# EAGLE design dintervalometer (EAGLE 7.2.0)
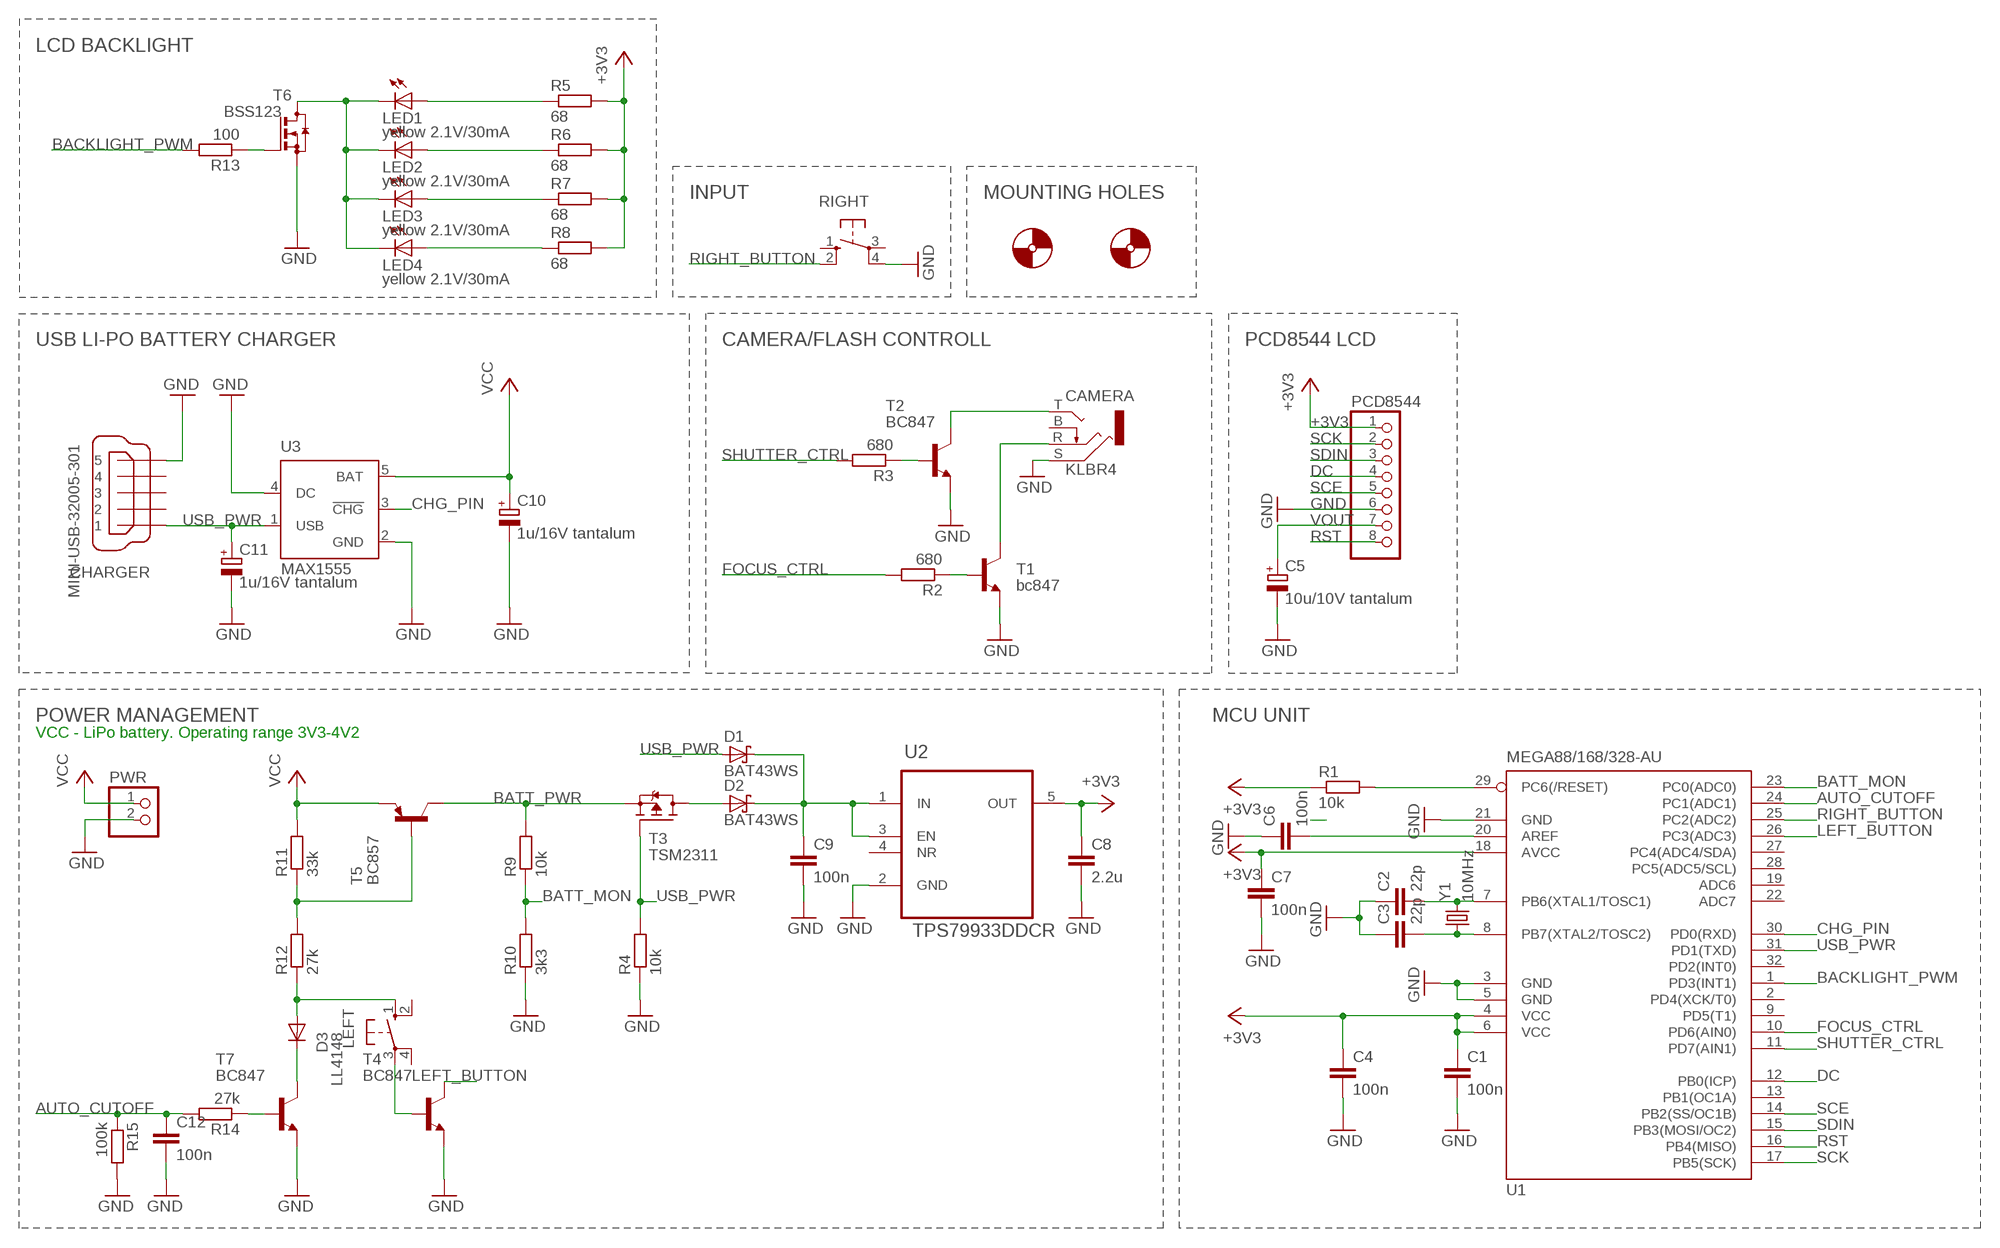
[diagram p0: schematic, sheet 1]

## Parts
C1  100n  C-EUC0805  [C0805]
C2  22p  C-EUC0805  [C0805]
C3  22p  C-EUC0805  [C0805]
C4  100n  C-EUC0805  [C0805]
C5  10u/10V tantalum  CPOL-EUSMCA  [SMC_A]
C6  100n  C-EUC0805  [C0805]
C7  100n  C-EUC0805  [C0805]
C8  2.2u  C-EUC0805  [C0805]
C9  100n  C-EUC0805  [C0805]
C10  1u/16V tantalum  CPOL-EUSMCA  [SMC_A]
C11  1u/16V tantalum  CPOL-EUSMCA  [SMC_A]
C12  100n  C-EUC0805  [C0805]
CAMERA  KLBR4  [KLBR4]
CHARGER  MINI-USB-32005-301  [32005-301]
D1  BAT43WS  [SOD323_ST]
D2  BAT43WS  [SOD323_ST]
D3  LL4148  DIODE-SOD80C  [SOD80C]
LED1  yellow 2.1V/30mA  LEDCHIP-LED0805  [CHIP-LED0805]
LED2  yellow 2.1V/30mA  LEDCHIP-LED0805  [CHIP-LED0805]
LED3  yellow 2.1V/30mA  LEDCHIP-LED0805  [CHIP-LED0805]
LED4  yellow 2.1V/30mA  LEDCHIP-LED0805  [CHIP-LED0805]
LEFT  10-XX  [B3F-10XX]
PCD8544  PINHD-1X8  [1X08]
PWR  PINHD-1X2/90  [1X02/90]
R1  10k  R-EU_M0805  [M0805]
R2  680  R-EU_M0805  [M0805]
R3  680  R-EU_M0805  [M0805]
R4  10k  R-EU_M0805  [M0805]
R5  68  R-EU_M0805  [M0805]
R6  68  R-EU_M0805  [M0805]
R7  68  R-EU_M0805  [M0805]
R8  68  R-EU_M0805  [M0805]
R9  10k  R-EU_M0805  [M0805]
R10  3k3  R-EU_M0805  [M0805]
R11  33k  R-EU_M0805  [M0805]
R12  27k  R-EU_M0805  [M0805]
R13  100  R-EU_M0805  [M0805]
R14  27k  R-EU_M0805  [M0805]
R15  100k  R-EU_M0805  [M0805]
RIGHT  10-XX  [B3F-10XX]
T1  bc847  BC847-NPN-SOT23-BEC  [SOT23-BEC]
T2  BC847  BC847-NPN-SOT23-BEC  [SOT23-BEC]
T3  TSM2311  [SOT23]
T4  BC847  [SOT23]
T5  BC857  BC857A-PNP-SOT23-BEC  [SOT23-BEC]
T6  BSS123  [SOT23]
T7  BC847  [SOT23]
U1  MEGA88/168/328-AU  MEGA8-AI  [TQFP32-08]
U2  TPS79933DDCR  TPS73033DBVT  [SOT95P290X145-5N]
U3  MAX1555  [SOT23-5L]
X1  2.8MM_HOLE  [2.8MM_HOLE]
X3  2.8MM_HOLE  [2.8MM_HOLE]
Y1  10MHz  CRYSTAL  [5X3.2MM]

## Nets
+3V3: C1.1 C4.1 C7.1 C8.1 PCD8544.1 R1.1 R5.2 R6.2 R7.2 R8.2 U1.4(VCC) U1.6(VCC) U1.18(AVCC) U2.5(OUT)
AUTO_CUTOFF: C12.1 R14.2 R15.1 U1.24(PC1(ADC1))
BACKLIGHT_PWM: R13.2 U1.1(PD3(INT1))
BATT_MON: R9.1 R10.2 U1.23(PC0(ADC0))
BATT_PWR: R9.2 T3.2(S) T5.C
CHG_PIN: U1.30(PD0(RXD)) U3.3(!CHG)
DC: PCD8544.4 U1.12(PB0(ICP))
FOCUS_CTRL: R2.2 U1.10(PD6(AIN0))
GND: C1.2 C2.1 C3.1 C4.2 C5.- C6.1 C7.2 C8.2 C9.2 C10.- C11.- C12.2 CAMERA.S CHARGER.5 PCD8544.6 PWR.2 R4.1 R10.1 R15.2 RIGHT.4(P1) T1.E T2.E T4.2(E) T6.2(S) T7.2(E) U1.3(GND) U1.5(GND) U1.21(GND) U2.2(GND) U3.2(GND) U3.4(DC)
LEFT_BUTTON: T4.3(C) U1.26(PC3(ADC3))
N$1: R1.2 U1.29(PC6(/RESET))
N$2: C2.2 U1.7(PB6(XTAL1/TOSC1)) Y1.3
N$3: C3.2 U1.8(PB7(XTAL2/TOSC2)) Y1.1
N$4: R3.1 T2.B
N$5: R11.1 R12.2 T5.B
N$6: C6.2 U1.20(AREF)
N$7: LED1.A R5.1
N$8: D3.A LEFT.1(S) R12.1
N$9: D3.C T7.3(C)
N$10: D2.A T3.3(D)
N$11: LEFT.3(P) T4.1(B)
N$12: LED1.C LED2.C LED3.C LED4.C T6.3(D)
N$13: R2.1 T1.B
N$14: R13.1 T6.1(G)
N$15: LED2.A R6.1
N$16: LED3.A R7.1
N$17: LED4.A R8.1
N$18: CAMERA.T T2.C
N$19: CAMERA.R T1.C
N$20: R14.1 T7.1(B)
N$21: C9.1 D1.C D2.C U2.1(IN) U2.3(EN)
RIGHT_BUTTON: RIGHT.2(S1) U1.25(PC2(ADC2))
RST: PCD8544.8 U1.16(PB4(MISO))
SCE: PCD8544.5 U1.14(PB2(SS/OC1B))
SCK: PCD8544.2 U1.17(PB5(SCK))
SDIN: PCD8544.3 U1.15(PB3(MOSI/OC2))
SHUTTER_CTRL: R3.2 U1.11(PD7(AIN1))
USB_PWR: C11.+ CHARGER.1 D1.A R4.2 T3.1(G) U1.31(PD1(TXD)) U3.1(USB)
VCC: C10.+ PWR.1 R11.2 T5.E U3.5(BAT)
VOUT: C5.+ PCD8544.7
Unconnected: CAMERA.B CHARGER.2 CHARGER.3 CHARGER.4 LEFT.2(S1) LEFT.4(P1) RIGHT.1(S) RIGHT.3(P) U1.2(PD4(XCK/T0)) U1.9(PD5(T1)) U1.13(PB1(OC1A)) U1.19(ADC6) U1.22(ADC7) U1.27(PC4(ADC4/SDA)) U1.28(PC5(ADC5/SCL)) U1.32(PD2(INT0)) U2.4(NR)

## Notes on the sheet
- LCD BACKLIGHT
- INPUT | MOUNTING HOLES
- USB LI-PO BATTERY CHARGER | CAMERA/FLASH CONTROLL | PCD8544 LCD
- POWER MANAGEMENT | MCU UNIT
- VCC - LiPo battery. Operating range 3V3-4V2

## Library data of the parts
C1-C4 C6-C9 C12 = rcl:C-EU: CAPACITOR, European symbol
C5 C10 C11 = rcl:CPOL-EU: POLARIZED CAPACITOR, European symbol
CAMERA = con-lumberg:KLBR4: Jack connectors according to JISC 6560, 3.5 mm Klinkeneinbaukupplung nach JISC 6560, 3,5 mm, 3-polig/ stereo, abgewinkelte Ausführung, mit Öffner, für Leiterplatten Source: Data sheet <http://www.lumberg.com/Produkte/PDFs/KLBR4.pdf>; MPN: KLBR 4; OC_FARNELL: 1217016; OC_NEWARK: 97K2709
CHARGER = con-cypressindustries:MINI-USB-: MINI USB-B Conector Source: www.cypressindustries.com; OC_FARNELL: unknown; OC_NEWARK: unknown
D1 D2 = diode:BAT43WS
D3 = diode:DIODE-: DIODE
LED1-LED4 = led:LED: LED OSRAM: - CHIPLED LG R971, LG N971, LY N971, LG Q971, LY Q971, LO R971, LY R971 LH N974, LH R974 LS Q976, LO Q976, LY Q976 LO Q996 - Hyper CHIPLED LW Q18S LB Q993, LB Q99A, LB R99A - SideLED LS A670, LO A670, LY A670, LG A670, LP A670 LB A673, LV A673, LT A673, LW A673 LH A674 LY A675 LS A676, LA A676, LO A676, LY A676, LW A676 LS A679, LY A679, LG A679 - Hyper Micro SIDELED® LS Y876, LA Y876, LO Y876, LY Y876 LT Y87S - SmartLED LW L88C, LW L88S LB L89C, LB L89S, LG L890 LS L89K, LO L89K, LY L89K LS L896, LA L896, LO L896, LY L896 - TOPLED LS T670, LO T670, LY T670, LG T670, LP T670 LSG T670, LSP T670, LSY T670, LOP T670, LYG T670 LG T671, LOG T671, LSG T671 LB T673, LV T673, LT T673, LW T673 LH T674 LS T676, LA T676, LO T676, LY T676, LB T676, LH T676, LSB T676, LW T676 LB T67C, LV T67C, LT T67C, LS T67K, LO T67K, LY T67K, LW E67C LS E67B, LA E67B, LO E67B, LY E67B, LB E67C, LV E67C, LT E67C LW T67C LS T679, LY T679, LG T679 LS T770, LO T770, LY T770, LG T770, LP T770 LB T773, LV T773, LT T773, LW T773 LH T774 LS E675, LA E675, LY E675, LS T675 LS T776, LA T776, LO T776, LY T776, LB T776 LHGB T686 LT T68C, LB T68C - Hyper Mini TOPLED® LB M676 - Mini TOPLED Santana® LG M470 LS M47K, LO M47K, LY M47K Source: http://www.osram.convergy.de LUXEON: - LUMILED® LXK2-PW12-R00, LXK2-PW12-S00, LXK2-PW14-U00, LXK2-PW14-V00 LXK2-PM12-R00, LXK2-PM12-S00, LXK2-PM14-U00 LXK2-PE12-Q00, LXK2-PE12-R00, LXK2-PE12-S00, LXK2-PE14-T00, LXK2-PE14-U00 LXK2-PB12-K00, LXK2-PB12-L00, LXK2-PB12-M00, LXK2-PB14-N00, LXK2-PB14-P00, LXK2-PB14-Q00 LXK2-PR12-L00, LXK2-PR12-M00, LXK2-PR14-Q00, LXK2-PR14-R00 LXK2-PD12-Q00, LXK2-PD12-R00, LXK2-PD12-S00 LXK2-PH12-R00, LXK2-PH12-S00 LXK2-PL12-P00, LXK2-PL12-Q00, LXK2-PL12-R00 Source: www.luxeon.com KINGBRIGHT: KA-3528ASYC Source: www.kingbright.com
LEFT RIGHT = switch-omron:10-XX: OMRON SWITCH; MPN: B3F-1000; OC_FARNELL: 176432; OC_NEWARK: 36M3542
PCD8544 = pinhead:PINHD-1X8: PIN HEADER
PWR = pinhead:PINHD-1X2: PIN HEADER
R1-R15 = rcl:R-EU_: RESISTOR, European symbol
T1 T2 = transistor-neu-to92:*-NPN-: NPN Transistror
T3 = transistor-fet:TSM2311: 20V P-Channel MOSFET
T4 T7 = transistor:BC847: NPN TRANSISTOR
T5 = transistor:*-PNP-: PNP Transistror
T6 = transistor-small-signal:BSS123: N-CHANNEL MOS FET
U1 = atmel:MEGA8: MICROCONTROLLER 8 Kbytes FLASH, 1 kbytes SRAM, 512 bytes EEPROM, USART, 6-channel 10 bit ADC, 2-channel 8 bit ADC Pin compatible with Atmega48, ATMega88, ATMega168 Source: avr.lbr; MPN: ATMEGA8-16AU; OC_FARNELL: 9171371; OC_NEWARK: 73M8863
U2 = TPS799:TPS73033DBVT: V REG LDO 0.2A +3.3V, SOT-23-5; MPN: TPS73033DBVT; OC_FARNELL: 1135395; OC_NEWARK: 71J8233; PACKAGE: SOT-23-5; SUPPLIER: TEXAS INSTRUMENTS
U3 = maxim:MAX1555: Dual-Input USB/AC Adapter 1-Cell Li+ Battery Chargers Source: http://www.maxim-ic.com .. MAX1551-MAX1555.pdf; MF: MAXIM; MPN: MAX1555EZK+T; OC_FARNELL: 1628222; OC_NEWARK: 59J2761
X1 X3 = dhole:2.8MM_HOLE
Y1 = crystal:CRYSTAL: CRYSTAL

## Board
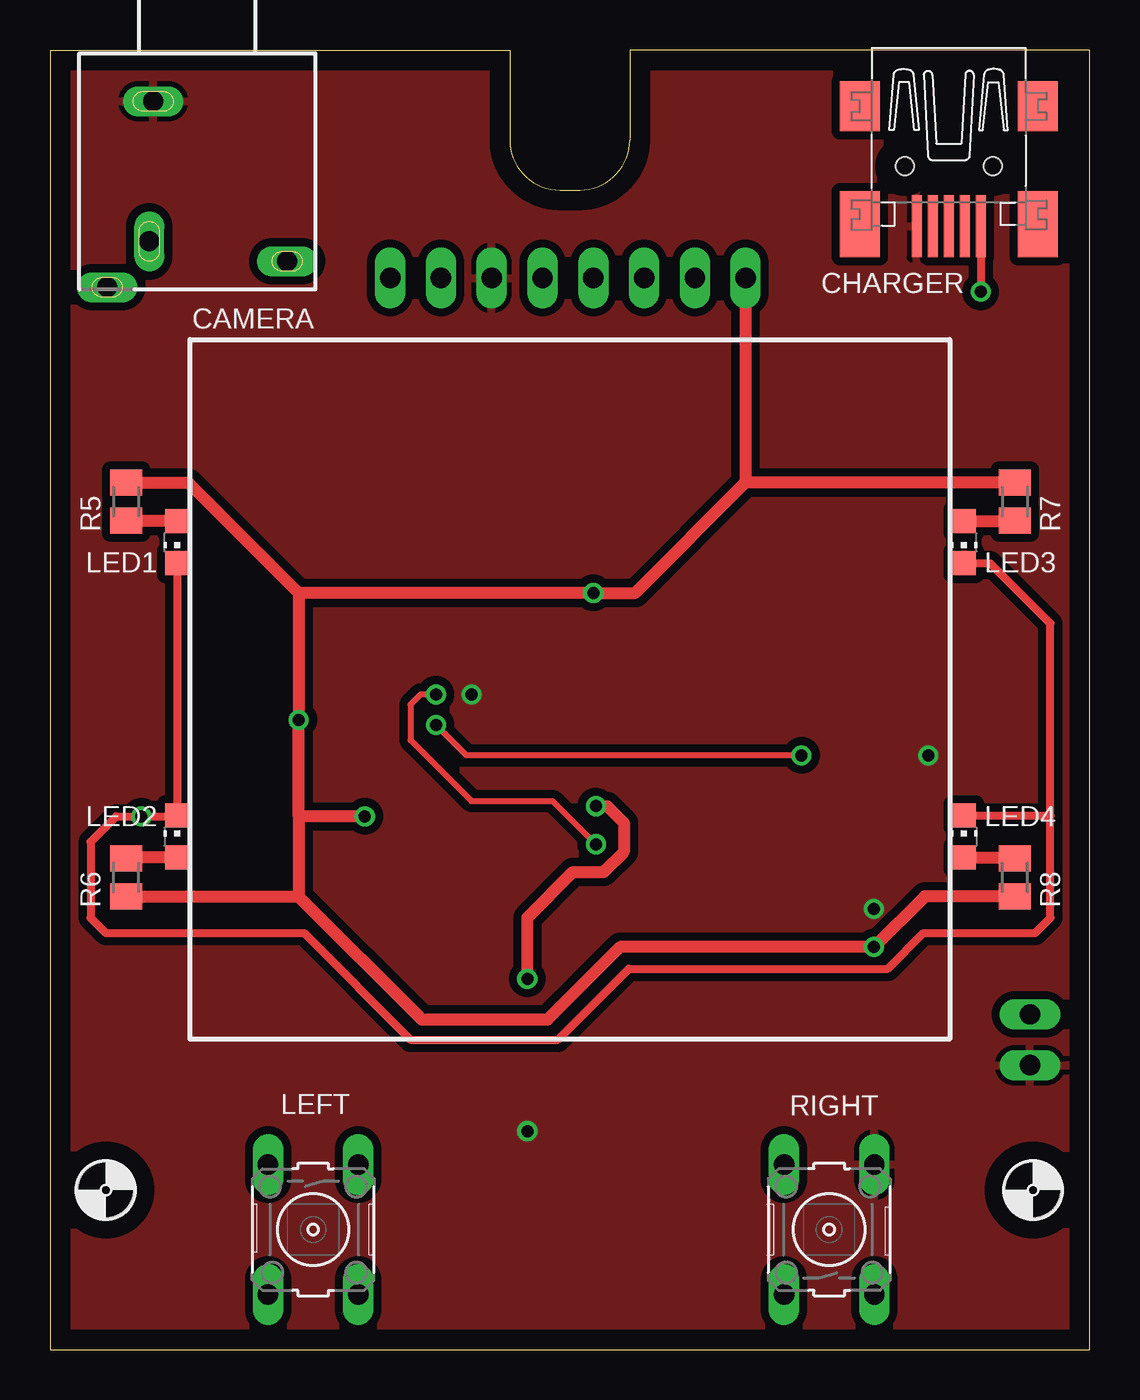
[diagram p1: board, top side]
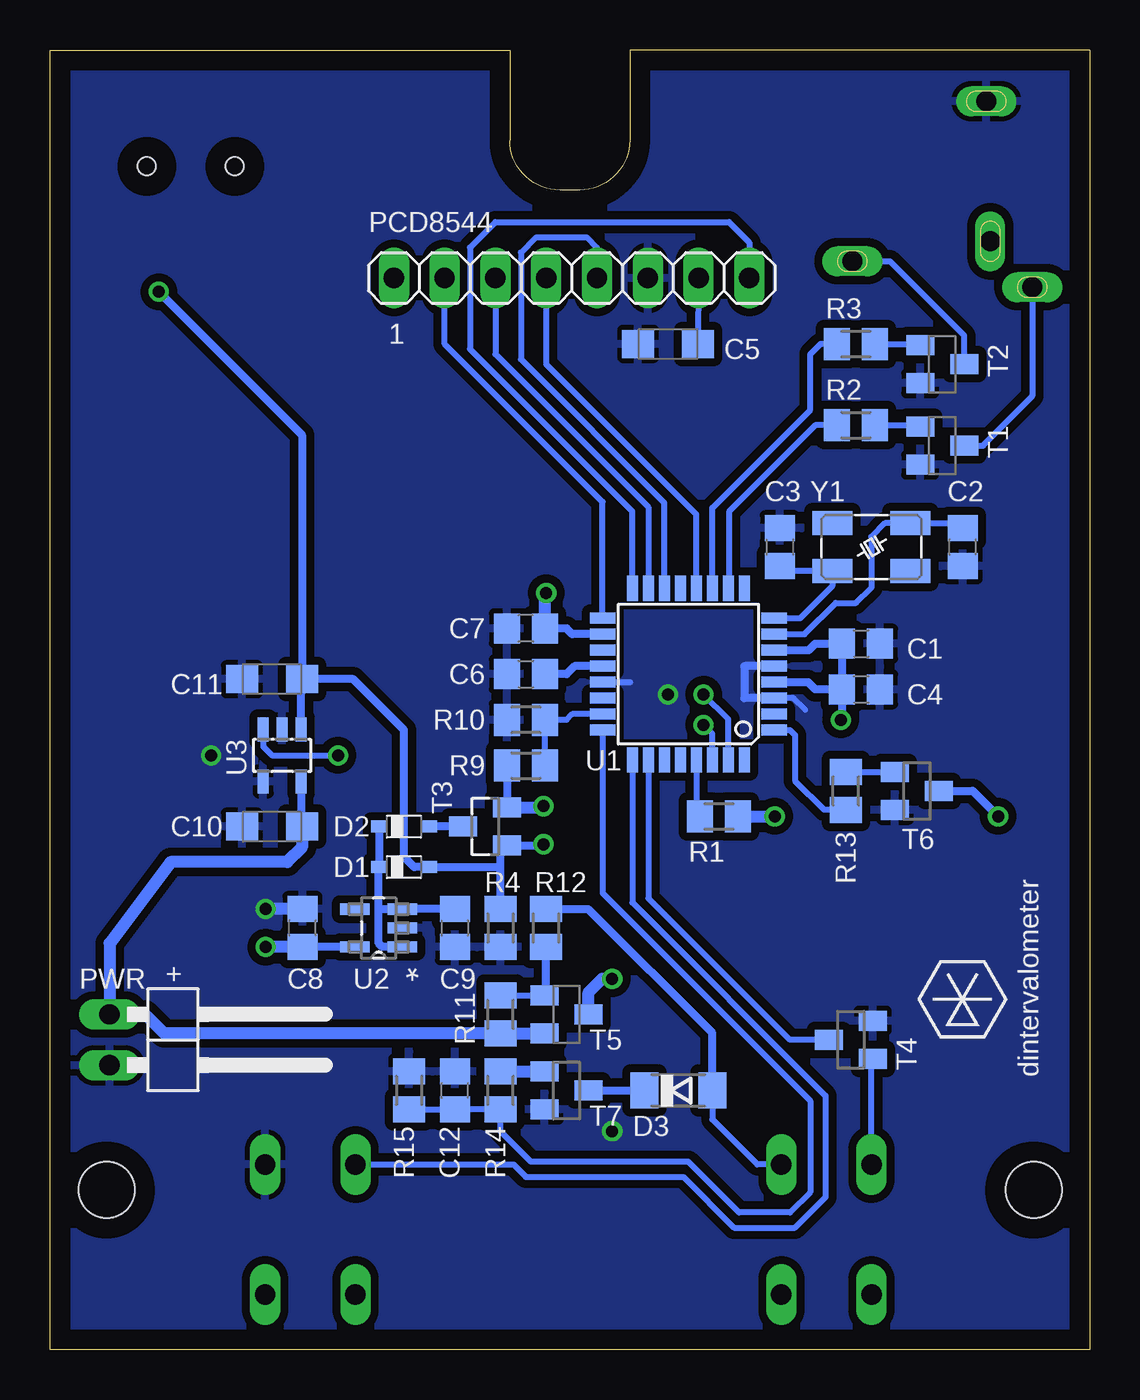
[diagram p2: board, bottom side, seen from below]

Size 52 x 65 mm. Coordinates in mm from the lower left corner, seen from the top.
Outline: 0,0 52,0 52,65 29,65 29,60.5 arc-90 26.5,58 25.5,58 arc-90 23,60.5 23,65 0,65 0,0
Copper layers (1*16): Top 0.035mm / dielectric 1.5mm / Bottom 0.035mm
Design rules "default *": minimum track width 12mil, minimum drill 23mil, track to track 10mil, track to pad 10mil, pad to pad 8mil, via to via 10mil, smd to smd 8mil, copper to edge 40mil, drill to drill 8mil, minimum pad ring 10mil, minimum via ring 8mil, stop-mask expansion 4mil, vias tented up to drill 0mil, thermal gap 10mil

### Footprints (pad centres in the part's own frame; a part is rotated, then mirrored left to right if it is on the bottom)
C0805 = smd 1.3 x 1.5: 1 -0.95,0; 2 0.95,0
SMC_A = smd 1.6 x 1.4: + -1.5,0; - 1.5,0
KLBR4 = drill 1 pad 1.3 long: B -2.4,-3.5; S -2.2,3.5 | drill 1 pad 1.2 long: R -4.5,-5.8; T 4.5,-4.5
32005-301 = smd 3.1 x 0.5: 1 3,1.6; 2 3,0.8; 3 3,0; 4 3,-0.8; 5 3,-1.6 | smd 2.5 x 2: M1 -3,-4.45; M2 -3,4.45 | smd 3.3 x 2: M3 2.9,4.45; M4 2.9,-4.45 | hole 0.9: 0,2.2; 0,-2.2
SOD323_ST = smd 0.8 x 0.6: A 1.25,0; C -1.25,0
SOD80C = smd 1.4 x 1.8: A 1.7,0; C -1.7,0
CHIP-LED0805 = smd 1.2 x 1.2: A 0,-1.05; C 0,1.05
B3F-10XX = drill 1.016 long: 1 -3.251,2.261; 2 3.251,2.261; 3 -3.251,-2.261; 4 3.251,-2.261
1X08 = drill 1.016 long: 1 -8.89,0; 2 -6.35,0; 3 -3.81,0; 4 -1.27,0; 5 1.27,0; 6 3.81,0; 7 6.35,0; 8 8.89,0
1X02/90 = drill 1.016 long: 1 -1.27,-3.81; 2 1.27,-3.81
M0805 = smd 1.3 x 1.6: 1 -0.95,0; 2 0.95,0
SOT23-BEC = smd 1 x 1.4: B -0.95,-1.1; C 0,1.1; E 0.95,-1.1
SOT23 = smd 1 x 1.4: 1 -0.95,-1.1; 2 0.95,-1.1; 3 0,1.1
TQFP32-08 = smd 1.27 x 0.559: 1 -4.293,2.8; 2 -4.293,2; 3 -4.293,1.2; 4 -4.293,0.4; 5 -4.293,-0.4; 6 -4.293,-1.2; 7 -4.293,-2; 8 -4.293,-2.8; 17 4.293,-2.8; 18 4.293,-2; 19 4.293,-1.2; 20 4.293,-0.4; 21 4.293,0.4; 22 4.293,1.2; 23 4.293,2; 24 4.293,2.8 | smd 0.559 x 1.27: 9 -2.8,-4.293; 10 -2,-4.293; 11 -1.2,-4.293; 12 -0.4,-4.293; 13 0.4,-4.293; 14 1.2,-4.293; 15 2,-4.293; 16 2.8,-4.293; 25 2.8,4.293; 26 2,4.293; 27 1.2,4.293; 28 0.4,4.293; 29 -0.4,4.293; 30 -1.2,4.293; 31 -2,4.293; 32 -2.8,4.293
SOT95P290X145-5N = smd 1.473 x 0.559: 1 -1.194,0.94; 2 -1.194,0; 3 -1.194,-0.94; 4 1.194,-0.94; 5 1.194,0.94
SOT23-5L = smd 0.55 x 1.2: 1 -0.95,-1.3; 2 0,-1.3; 3 0.95,-1.3; 4 0.95,1.3; 5 -0.95,1.3
2.8MM_HOLE = hole 2.8: 0,0
5X3.2MM = smd 2 x 1.2: 1 -1.95,-1.2; 2 1.95,-1.2; 3 1.95,1.2; 4 -1.95,1.2

### Placement (x,y rotation side)
C1  11.43,35.31 0 bottom
C2  6.35,40.13 90 bottom
C3  15.49,40.13 270 bottom
C4  11.43,33.02 0 bottom
C5  21.08,50.29 180 bottom
C6  28.19,33.78 0 bottom
C7  28.19,36.07 180 bottom
C8  39.37,21.08 90 bottom
C9  31.75,21.08 270 bottom
C10  40.89,26.16 180 bottom
C11  40.89,33.53 180 bottom
C12  31.75,12.95 90 bottom
CAMERA  7.37,58.93 0 top
CHARGER  44.96,59.18 270 top
D1  34.29,24.13 0 bottom
D2  34.29,26.16 0 bottom
D3  20.57,12.95 0 bottom
LED1  6.35,40.39 180 top
LED2  6.35,25.65 0 top
LED3  45.72,40.39 180 top
LED4  45.72,25.65 0 top
LEFT  13.16,6 270 top
PCD8544  25.91,53.59 0 bottom
PWR  45.21,15.49 270 bottom
R1  18.54,26.67 180 bottom
R2  11.68,46.23 180 bottom
R3  11.68,50.29 180 bottom
R4  29.46,21.08 90 bottom
R5  3.81,42.42 90 top
R6  3.81,23.62 270 top
R7  48.26,42.42 90 top
R8  48.26,23.62 270 top
R9  28.19,29.21 180 bottom
R10  28.19,31.5 0 bottom
R11  29.46,16.76 270 bottom
R12  27.18,21.08 270 bottom
R13  12.19,27.94 270 bottom
R14  29.46,12.95 270 bottom
R15  34.04,12.95 90 bottom
RIGHT  38.98,6 90 top
T1  7.37,45.21 270 bottom
T2  7.37,49.28 270 bottom
T3  30.23,26.16 90 bottom
T4  11.94,15.49 90 bottom
T5  26.16,16.76 270 bottom
T6  8.64,27.94 270 bottom
T7  26.16,12.95 270 bottom
U1  20.07,33.78 180 bottom
U2  35.56,21.08 180 bottom
U3  40.39,29.72 180 bottom
X1  49.17,7.98 0 top
X3  2.79,7.98 0 top
Y1  10.92,40.13 0 bottom

### Tracks (layer width: path | path; a pad name or v marks a point on that pad's centre or on a via)
+3V3  (via drill 0.6)
  Top 0.61: PCD8544.1 34.8,43.37 | R8.2 43.75,22.67 v41.21,20.13 28.51,20.13 24.89,16.51 18.61,16.51 12.45,22.67 | R6.2 12.45,22.67 | 12.45,26.67 v12.45,31.5 12.45,37.85 | v15.75,26.67 12.45,26.67 | 12.45,26.67 12.45,22.67 | R7.2 34.8,43.37 | 34.8,43.37 29.28,37.85 v27.18,37.85 12.45,37.85 | R5.2 6.92,43.37 12.45,37.85
  Bottom 0.305: 39.36,20.14 C8.1
  Bottom 0.406: 18.03,26.48 R1.1 | U1.6 14.04,34.98 13.72,35.31 C1.1 C4.1 | U1.4 14.08,33.38 13.72,33.02 C4.1 | C4.1 12.38,31.56 | U2.5 39.36,20.14 | U1.18 25.88,35.78 26.16,36.07 C7.1
  Bottom 0.61: R1.1 v15.75,26.67 | 12.38,31.56 v12.45,31.5 | C8.1 v41.21,20.13 | C7.1 27.24,37.78 v27.18,37.85
AUTO_CUTOFF
  Bottom 0.305: U1.24 24.36,22.84 13.97,12.45 13.97,7.87 14.99,6.86 17.53,6.86 20.07,9.4 27.94,9.4 29.46,10.92 R14.2 C12.1 R15.1
BACKLIGHT_PWM
  Bottom 0.305: R13.2 13.27,26.99 14.73,28.45 14.73,30.73 14.98,30.98 U1.1
BATT_MON
  Bottom 0.305: R9.1 R10.2 26.16,31.5 25.88,31.78 U1.23
BATT_PWR  (via drill 0.6)
  Top 0.61: v27.3,27.18 27.87,27.18 28.7,26.35 28.7,24.89 27.69,23.88 26.16,23.88 23.88,21.59 v23.88,18.54
  Bottom 0.305: 29.14,27.5 29.13,27.77 T3.2
  Bottom 0.406: R9.2 29.14,27.5 | T5.C 25.32,16.68
  Bottom 0.61: T3.2 27.37,27.11 v27.3,27.18 | v23.88,18.54 24.38,18.54 25.06,17.86 T5.C
CHG_PIN  (via drill 0.6)
  Top 0.305: v37.59,29.72 20.83,29.72 v19.3,31.24
  Bottom 0.305: U3.3 41.34,30.16 40.89,29.72 v37.59,29.72 | U1.30 18.87,30.8 v19.3,31.24
DC
  Bottom 0.305: PCD8544.4 27.18,49.28 19.67,41.76 U1.12
FOCUS_CTRL
  Bottom 0.305: R2.2 13.72,46.23 18.03,41.91 18.03,38.11 U1.10
GND  (via drill 0.6)
  Bottom 0.305: 14.22,32 14.8,32.58 U1.3 | U1.21 22.97,33.38
  Bottom 0.406: 29.4,34.04 C6.1 | U1.5 17.27,34.18 17.27,32.58 U1.3
  Bottom 0.61: C8.2 v41.21,22.03
  other vias: 43.94,29.72 21.08,32.77 23.88,10.92
  pour Bottom (isolate 0.406): 0.25,65.02 52.07,65.02 52.07,0 0,0 0,65.02
  pour Top (isolate 0.406): 0.25,65.02 52.07,65.02 52.07,0 0,0 0,65.02
LEFT_BUTTON
  Bottom 0.305: U1.26 22.07,22.57 14.99,15.49 T4.3
N$1
  Bottom 0.305: U1.29 19.67,26.67 R1.2
N$2
  Bottom 0.305: U1.7 14.26,35.78 12.7,37.34 11.68,37.34 10.92,38.1 10.92,40.64 10.23,41.33 Y1.3 6.6,41.33 C2.2
N$3
  Bottom 0.305: C3.2 15.74,38.93 Y1.1 12.87,38.18 14.47,36.58 U1.8
N$4
  Bottom 0.305: R3.1 8.53,50.29 T2.B
N$5
  Bottom 0.305: R11.1 T5.B
  Bottom 0.406: T5.B 27.18,17.71 R12.2
N$6
  Bottom 0.406: U1.20 25.76,34.18 26.16,33.78 C6.2
N$7
  Top 0.61: LED1.A 3.81,41.44 R5.1
N$8
  Bottom 0.305: LEFT.1 16.62,9.25 18.87,11.51 D3.A
  Bottom 0.406: R12.1 25.08,22.03 18.87,15.83 D3.A
N$9
  Bottom 0.406: T7.3 D3.C
N$10
  Bottom 0.406: T3.3 D2.A
N$11
  Bottom 0.305: LEFT.3 10.9,14.48 T4.1
N$12  (via drill 0.6)
  Top 0.406: v4.57,26.67 6.38,26.67 LED2.C | LED1.C LED2.C | LED2.C 6.32,26.67 3.3,26.67 2.03,25.4 2.03,21.59 2.79,20.83 12.7,20.83 18.03,15.49 25.4,15.49 28.96,19.05 41.91,19.05 43.69,20.83 49.28,20.83 50.04,21.59 50.04,26.7 | 50.04,26.7 50.04,36.32 47.02,39.34 LED3.C | LED4.C 50.04,26.7
  Bottom 0.406: T6.3 5.84,27.94 v4.57,26.67
N$13
  Bottom 0.305: R2.1 8.53,46.23 T1.B
N$14
  Bottom 0.305: R13.1 T6.1
N$15
  Top 0.61: LED2.A 3.81,24.6 R6.1
N$16
  Top 0.61: LED3.A 48.23,41.44 R7.1
N$17
  Top 0.61: LED4.A 48.23,24.6 R8.1
N$18
  Bottom 0.305: CAMERA.T 9.98,54.43 6.27,50.72 T2.C
N$19
  Bottom 0.305: CAMERA.R 2.87,47.68 5.33,45.21 T1.C
N$20
  Bottom 0.61: R14.1 T7.1
N$21
  Bottom 0.305: 35.48,22.02 35.56,22.1 | 34.36,22.03 U2.3 | 35.56,24.11 D1.C
  Bottom 0.406: U2.1 35.38,20.14 35.56,20.32 35.56,22.1 35.56,24.11 | U2.3 35.48,22.02 | C9.1 34.36,22.03 | D2.C D1.C
RIGHT_BUTTON
  Bottom 0.305: U1.25 22.87,22.36 13.21,12.7 13.21,7.62 14.73,6.1 17.78,6.1 20.32,8.64 28.19,8.64 28.81,9.25 RIGHT.2
RST
  Bottom 0.305: PCD8544.8 17.02,55.37 18.03,56.39 29.72,56.39 30.99,55.12 30.99,50.04 22.87,41.92 U1.16
SCE
  Bottom 0.305: PCD8544.5 24.64,55.12 25.15,55.63 27.69,55.63 28.45,54.86 28.45,49.53 21.27,42.35 U1.14
SCK
  Bottom 0.305: U1.17 24.36,42.39 32.26,50.29 PCD8544.2
SDIN
  Bottom 0.305: PCD8544.3 29.72,49.78 22.07,42.13 U1.15
SHUTTER_CTRL
  Bottom 0.305: R3.2 13.46,50.29 13.97,49.78 13.97,46.99 18.87,42.09 U1.11
USB_PWR  (via drill 0.6)
  Top 0.305: v19.3,32.77 18.54,32.77 18.03,32.26 18.03,30.48 21.08,27.43 25.15,27.43 v27.3,25.27
  Top 0.406: CHARGER.1 v46.56,52.91
  Bottom 0.305: U1.31 18.07,31.53 v19.3,32.77 | 29.46,24.87 T3.1 | 27.37,25.21 v27.3,25.27
  Bottom 0.406: U3.1 39.44,32.86 C11.+ | R4.2 29.46,24.13 | 29.46,24.13 29.46,24.87 | 29.46,24.13 D1.A 33.78,24.13 34.29,24.64 34.29,30.99 36.83,33.53 C11.+ | T3.1 27.37,25.21 | 39.37,33.55 C11.+ | v46.56,52.91 39.39,45.74 C11.+
VCC
  Bottom 0.305: 39.44,26.51 C10.+
  Bottom 0.406: U3.5 39.44,26.51
  Bottom 0.61: C10.+ 39.39,25.12 40.13,24.38 45.97,24.38 49.02,20.32 PWR.1 47.24,16.76 46.29,15.81 R11.2 T5.E
VOUT
  Bottom 0.305: PCD8544.7 C5.+

### Text on the board
bPlace: dintervalometer
bNames: 1 | +